# Altium schematic sheet Sch_front_led.SchDoc
size Letter
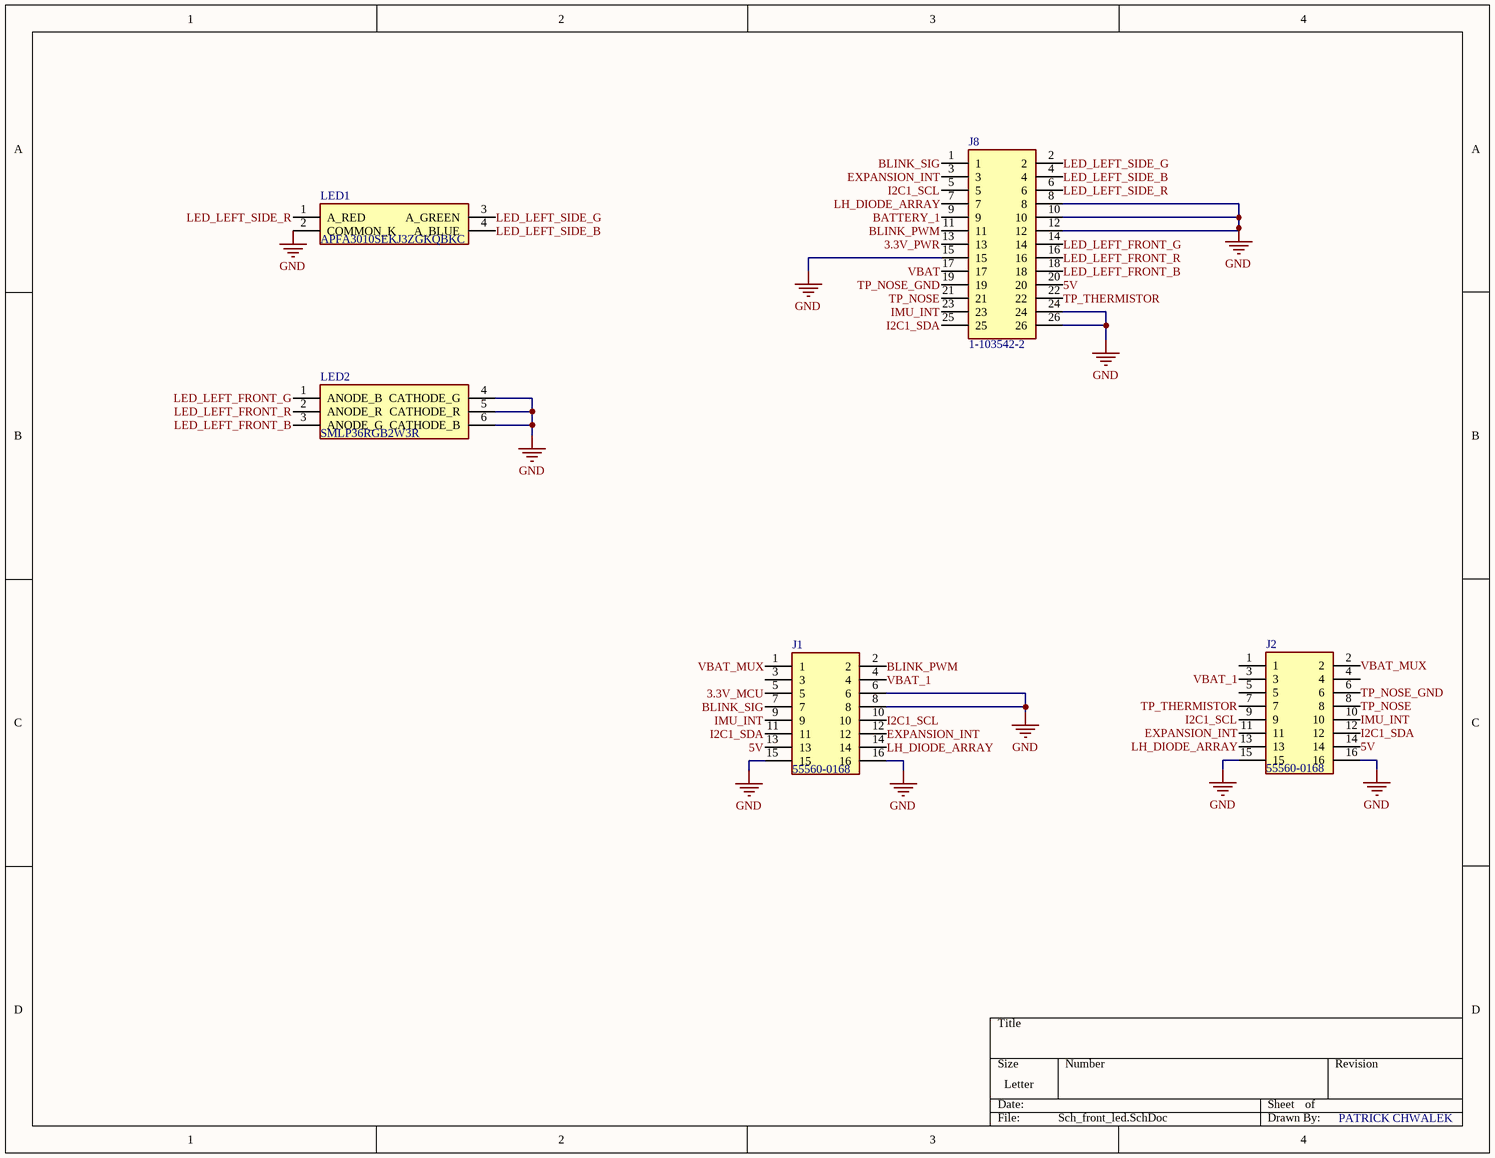
[diagram p0: Sch_front_led.SchDoc]

## Parts
J1  55560-0168  [555600168]
J2  55560-0168  [555600168]
J8  1-103542-2  [HDRV26W89P254X254_2X13_3261X506X1074P]
LED1  APFA3010SEKJ3ZGKQBKC  [KPFA-3010RGBC-11]
LED2  SMLP36RGB2W3R  [ROHM-1510-(0604)]

## Nets
GND: J1.6 J1.8 J1.15 J1.16 J2.15 J2.16 J8.8 J8.10 J8.12 J8.15 J8.24 J8.26 LED1.2(COMMON_K) LED2.4(CATHODE_G) LED2.5(CATHODE_R) LED2.6(CATHODE_B)
3.3V_MCU: J1.5
3.3V_PWR: J8.13
5V: J1.13 J2.14 J8.20
BATTERY_1: J8.9
BLINK_PWM: J1.2 J8.11
BLINK_SIG: J1.7 J8.1
EXPANSION_INT: J1.12 J2.11 J8.3
I2C1_SCL: J1.10 J2.9 J8.5
I2C1_SDA: J1.11 J2.12 J8.25
IMU_INT: J1.9 J2.10 J8.23
LED_LEFT_FRONT_B: J8.18 LED2.3(ANODE_G)
LED_LEFT_FRONT_G: J8.14 LED2.1(ANODE_B)
LED_LEFT_FRONT_R: J8.16 LED2.2(ANODE_R)
LED_LEFT_SIDE_B: J8.4 LED1.4(A_BLUE)
LED_LEFT_SIDE_G: J8.2 LED1.3(A_GREEN)
LED_LEFT_SIDE_R: J8.6 LED1.1(A_RED)
LH_DIODE_ARRAY: J1.14 J2.13 J8.7
TP_NOSE: J2.8 J8.21
TP_NOSE_GND: J2.6 J8.19
TP_THERMISTOR: J2.7 J8.22
VBAT: J8.17
VBAT_1: J1.4 J2.3
VBAT_MUX: J1.1 J2.2

Not connected (* = marked no-connect by the designer): J1 3; J2 1 4 5

## Notes on the sheet
- PATRICK CHWALEK

## Library data of the parts
J1 J2 = 55560-0168: Connector; Manufacturer_Name: Molex; Allied_Number: 70374726; Datasheet Link: https://www.molex.com/pdm_docs/sd/555600168_sd.pdf; Height: 1.15mm; Manufacturer_Part_Number: 55560-0168; Mouser Part Number: 538-55560-0168; Mouser Price/Stock: https://www.mouser.com/Search/Refine.aspx?Keyword=538-55560-0168; RS Part Number: 7206558P; RS Price/Stock: http://uk.rs-online.com/web/p/products/7206558P; Allied Price/Stock: https://www.alliedelec.com/molexincorporated-55560-0168/70374726/
J8 = 1-103542-2: Connector; Manufacturer_Name: TE Connectivity; Datasheet Link: http://www.te.com/commerce/DocumentDelivery/DDEController?Action=showdoc&DocId=Customer+Drawing%7F103542%7FJ3%7Fpdf%7FEnglish%7FENG_CD_103542_J3.pdf%7F1-103542-2; Height: 10.744mm; Manufacturer_Part_Number: 1-103542-2; Mouser Part Number: 571-1-103542-2; Mouser Price/Stock: https://www.mouser.com/Search/Refine.aspx?Keyword=571-1-103542-2
LED1 = APFA3010SEKJ3ZGKQBKC: LED; Manufacturer_Name: Kingbright; Allied_Number: 70820377; Datasheet Link: http://www.kingbrightusa.com/images/catalog/SPEC/APFA3010SEKJ3ZGKQBKC.pdf; Manufacturer_Part_Number: APFA3010SEKJ3ZGKQBKC; Mouser Part Number: 604-APFA3010SEKJ3ZGK; Mouser Price/Stock: https://www.mouser.com/Search/Refine.aspx?Keyword=604-APFA3010SEKJ3ZGK; Allied Price/Stock: https://www.alliedelec.com/kingbright-apfa3010sekj3zgkqbkc/70820377/
LED2 = SMLP36RGB2W3R: LED; Manufacturer_Name: ROHM Semiconductor; Datasheet Link: http://www.rohm.com/web/global/datasheet/SMLP36RGB2W(R); Manufacturer_Part_Number: SMLP36RGB2W3R; Mouser Part Number: 755-SMLP36RGB2W3R; Mouser Price/Stock: https://www.mouser.com/Search/Refine.aspx?Keyword=755-SMLP36RGB2W3R; RS Part Number: 1246884; RS Price/Stock: https://uk.rs-online.com/web/p/products/1246884